# Altium schematic sheet v1.0.SchDoc
size 83 x 38 mm
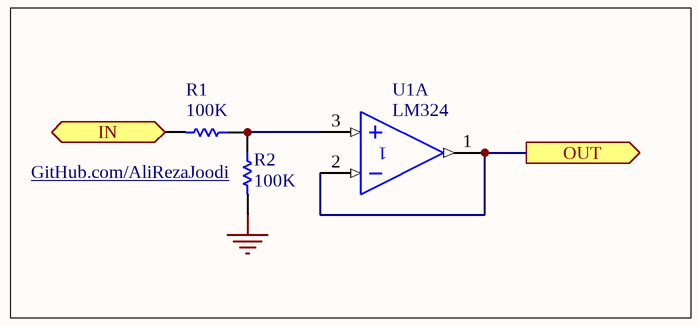
[diagram p0: v1.0.SchDoc]

## Parts
R1  100K  [AXIAL-0.4]
R2  100K  [AXIAL-0.4]
U1  LM324  [646-06]  (part A of 5)

## Ports
IN (in), OUT (out)

## Nets
GND: R2.2
IN: R1.2 ; port IN
OUT: U1.1(OUT) U1.2(IN-) ; port OUT
NetR1_1: R1.1 R2.1 U1.3(IN+)

## Notes on the sheet
- (near R2) GitHub.com/AliRezaJoodi

## Library data of the parts
R1 R2 = Res1: Resistor; Published: 8-Jun-2000; LatestRevisionDate: 17-Jul-2002; LatestRevisionNote: Re-released for DXP Platform.; PackageReference: AXIAL-0.3; Publisher: Altium Limited
U1 = LM324: Quad Low-Power Operational Amplifier; Published: 17-Jul-2002; LatestRevisionDate: 06-Jun-2005; LatestRevisionNote: Stylized 3D Model Added.; DatasheetVersion: 1988; PackageVersion: 1997; PackageReference: 646-06; Publisher: Altium Limited; PackageDescription: DIP; 14 Leads; Row Spacing 7.62 mm; Pitch 2.54 mm; ComponentLink1Description: Manufacturer Link; ComponentLink1URL: http://www.onsemi.com/site/products/parametrics/0,4446,251,00.html; ComponentLink2Description: Datasheet; ComponentLink2URL: http://www.onsemi.com/pub/Collateral/LM324-D.PDF